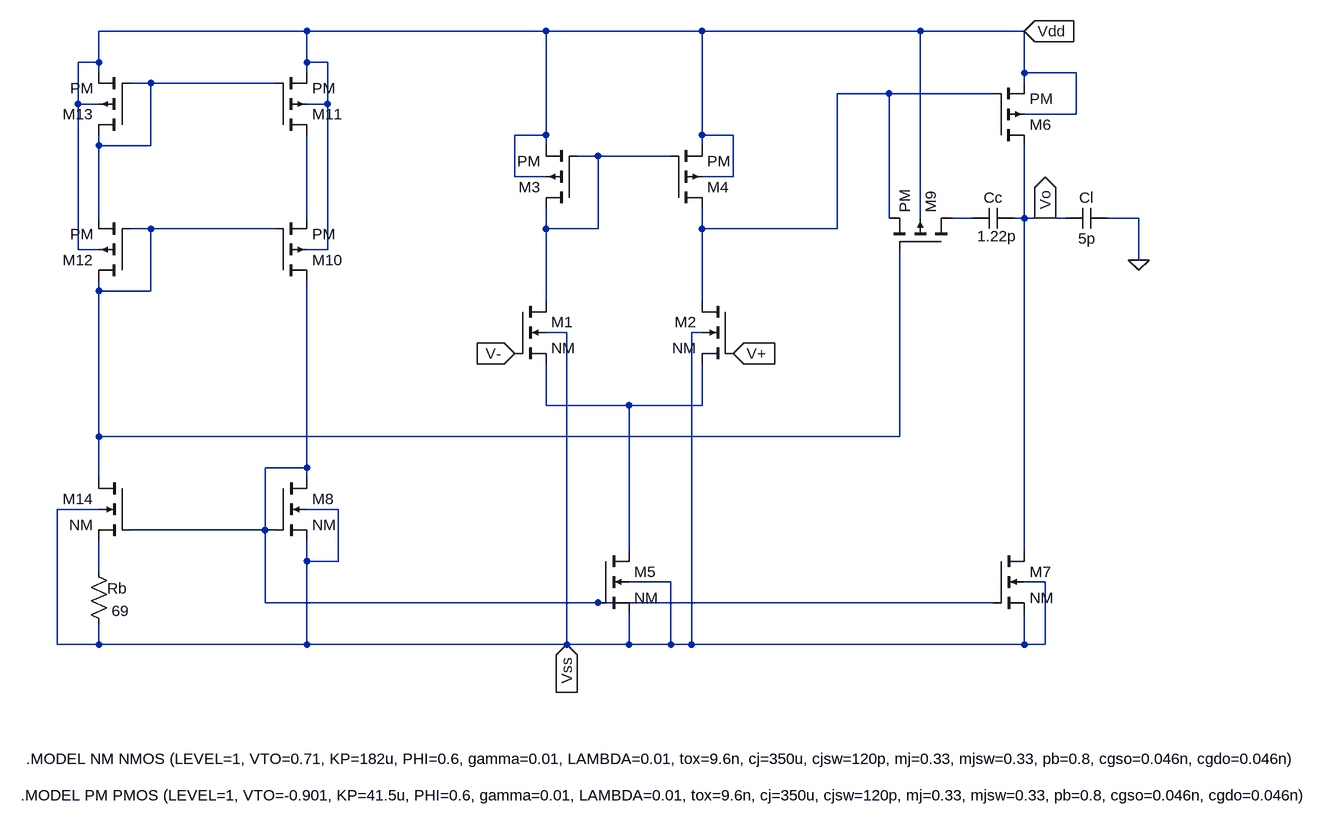
[diagram p0: schematic modified_schematic.asc]
modified_schematic.asc, the LTspice schematic file:
Version 4
SHEET 1 2312 680
WIRE 448 -816 128 -816
WIRE 816 -816 448 -816
WIRE 1056 -816 816 -816
WIRE 1392 -816 1056 -816
WIRE 1552 -816 1392 -816
WIRE 128 -768 128 -816
WIRE 128 -768 96 -768
WIRE 448 -768 448 -816
WIRE 480 -768 448 -768
WIRE 128 -752 128 -768
WIRE 448 -752 448 -768
WIRE 1552 -752 1552 -816
WIRE 1632 -752 1552 -752
WIRE 208 -736 176 -736
WIRE 400 -736 208 -736
WIRE 1552 -736 1552 -752
WIRE 1344 -720 1264 -720
WIRE 1504 -720 1344 -720
WIRE 96 -704 96 -768
WIRE 128 -704 96 -704
WIRE 480 -704 480 -768
WIRE 480 -704 448 -704
WIRE 1632 -688 1632 -752
WIRE 1632 -688 1552 -688
WIRE 816 -656 816 -816
WIRE 816 -656 768 -656
WIRE 1056 -656 1056 -816
WIRE 1104 -656 1056 -656
WIRE 128 -640 128 -656
WIRE 208 -640 208 -736
WIRE 208 -640 128 -640
WIRE 816 -640 816 -656
WIRE 1056 -640 1056 -656
WIRE 896 -624 864 -624
WIRE 1008 -624 896 -624
WIRE 768 -592 768 -656
WIRE 816 -592 768 -592
WIRE 1104 -592 1104 -656
WIRE 1104 -592 1056 -592
WIRE 128 -528 128 -640
WIRE 448 -528 448 -656
WIRE 1344 -528 1344 -720
WIRE 1392 -528 1392 -816
WIRE 1472 -528 1440 -528
WIRE 1552 -528 1552 -640
WIRE 1552 -528 1536 -528
WIRE 1584 -528 1552 -528
WIRE 1616 -528 1584 -528
WIRE 1728 -528 1680 -528
WIRE 208 -512 176 -512
WIRE 400 -512 208 -512
WIRE 816 -512 816 -544
WIRE 896 -512 896 -624
WIRE 896 -512 816 -512
WIRE 1056 -512 1056 -544
WIRE 1264 -512 1264 -720
WIRE 1264 -512 1056 -512
WIRE 96 -480 96 -704
WIRE 128 -480 96 -480
WIRE 480 -480 480 -704
WIRE 480 -480 448 -480
WIRE 1728 -464 1728 -528
WIRE 128 -416 128 -432
WIRE 208 -416 208 -512
WIRE 208 -416 128 -416
WIRE 816 -400 816 -512
WIRE 1056 -400 1056 -512
WIRE 848 -352 816 -352
WIRE 1056 -352 1040 -352
WIRE 816 -240 816 -304
WIRE 944 -240 816 -240
WIRE 1056 -240 1056 -304
WIRE 1056 -240 944 -240
WIRE 128 -192 128 -416
WIRE 1360 -192 1360 -480
WIRE 1360 -192 128 -192
WIRE 448 -144 448 -432
WIRE 448 -144 384 -144
WIRE 128 -128 128 -192
WIRE 448 -128 448 -144
WIRE 128 -80 64 -80
WIRE 496 -80 448 -80
WIRE 384 -48 384 -144
WIRE 384 -48 176 -48
WIRE 400 -48 384 -48
WIRE 944 -16 944 -240
WIRE 1552 -16 1552 -528
WIRE 448 0 448 -32
WIRE 496 0 496 -80
WIRE 496 0 448 0
WIRE 128 16 128 -32
WIRE 1008 32 944 32
WIRE 1584 32 1552 32
WIRE 384 64 384 -48
WIRE 896 64 384 64
WIRE 1504 64 896 64
WIRE 64 128 64 -80
WIRE 128 128 128 96
WIRE 128 128 64 128
WIRE 448 128 448 0
WIRE 448 128 128 128
WIRE 848 128 848 -352
WIRE 848 128 448 128
WIRE 944 128 944 80
WIRE 944 128 848 128
WIRE 1008 128 1008 32
WIRE 1008 128 944 128
WIRE 1040 128 1040 -352
WIRE 1040 128 1008 128
WIRE 1552 128 1552 80
WIRE 1552 128 1040 128
WIRE 1584 128 1584 32
WIRE 1584 128 1552 128
FLAG 1728 -464 0
FLAG 1552 -816 Vdd
IOPIN 1552 -816 In
FLAG 848 128 Vss
IOPIN 848 128 In
FLAG 1104 -320 V+
IOPIN 1104 -320 In
FLAG 768 -320 V-
IOPIN 768 -320 In
FLAG 1584 -528 Vo
IOPIN 1584 -528 Out
SYMBOL nmos4 400 -128 R0
SYMATTR InstName M8
SYMATTR Value2 l=1u w=4.58u
SYMATTR Value NM
SYMBOL nmos4 176 -128 M0
SYMATTR InstName M14
SYMATTR Value2 l=1u w=4.58u
SYMATTR Value NM
SYMBOL nmos4 768 -400 R0
SYMATTR InstName M1
SYMATTR Value2 l=1u w=0.66u
SYMATTR Value NM
SYMBOL nmos4 1104 -400 M0
SYMATTR InstName M2
SYMATTR Value2 l=1u w=0.66u
SYMATTR Value NM
SYMBOL nmos4 896 -16 R0
SYMATTR InstName M5
SYMATTR Value2 l=1u w=4.58u
SYMATTR Value NM
SYMBOL nmos4 1504 -16 R0
SYMATTR InstName M7
SYMATTR Value2 l=1u w=23.23u
SYMATTR Value NM
SYMBOL pmos4 864 -544 R180
SYMATTR InstName M3
SYMATTR Value2 l=1u w=3.3u
SYMATTR Value PM
SYMBOL pmos4 176 -656 R180
SYMATTR InstName M13
SYMATTR Value2 l=1u w=6.57u
SYMATTR Value PM
SYMBOL pmos4 176 -432 R180
SYMATTR InstName M12
SYMATTR Value2 l=1u w=6.57u
SYMATTR Value PM
SYMBOL pmos4 400 -432 M180
SYMATTR InstName M10
SYMATTR Value2 l=1u w=6.57u
SYMATTR Value PM
SYMBOL pmos4 400 -656 M180
SYMATTR InstName M11
SYMATTR Value2 l=1u w=6.57u
SYMATTR Value PM
SYMBOL pmos4 1008 -544 M180
SYMATTR InstName M4
SYMATTR Value2 l=1u w=3.3u
SYMATTR Value PM
SYMBOL pmos4 1504 -640 M180
SYMATTR InstName M6
SYMATTR Value2 l=1u w=33.35u
SYMATTR Value PM
SYMBOL pmos4 1440 -480 M270
SYMATTR InstName M9
SYMATTR Value2 l=1u w=6.57u
SYMATTR Value PM
SYMBOL res 112 0 R0
WINDOW 0 29 42 Left 2
SYMATTR InstName Rb
SYMATTR Value 69
SYMBOL cap 1536 -544 R90
WINDOW 0 0 32 VBottom 2
WINDOW 3 59 26 VBottom 2
SYMATTR InstName Cc
SYMATTR Value 1.22p
SYMBOL cap 1680 -544 R90
WINDOW 0 0 32 VBottom 2
WINDOW 3 32 32 VTop 2
SYMATTR InstName Cl
SYMATTR Value 5p
TEXT 8 360 Left 2 !.MODEL PM PMOS (LEVEL=1, VTO=-0.901, KP=41.5u, PHI=0.6, gamma=0.01, LAMBDA=0.01, tox=9.6n, cj=350u, cjsw=120p, mj=0.33, mjsw=0.33, pb=0.8, cgso=0.046n, cgdo=0.046n)
TEXT 16 304 Left 2 !.MODEL NM NMOS (LEVEL=1, VTO=0.71, KP=182u, PHI=0.6, gamma=0.01, LAMBDA=0.01, tox=9.6n, cj=350u, cjsw=120p, mj=0.33, mjsw=0.33, pb=0.8, cgso=0.046n, cgdo=0.046n)

The netlist it stands for:
* modified_schematic.asc
M8 N008 N008 Vss Vss NM l=1u w=4.58u
M14 N006 N008 N009 Vss NM l=1u w=4.58u
M1 N003 V- N007 Vss NM l=1u w=0.66u
M2 N002 V+ N007 Vss NM l=1u w=0.66u
M5 N007 N008 Vss Vss NM l=1u w=4.58u
M7 Vo N008 Vss Vss NM l=1u w=23.23u
M3 N003 N003 Vdd Vdd PM l=1u w=3.3u
M13 N001 N001 Vdd Vdd PM l=1u w=6.57u
M12 N006 N006 N001 Vdd PM l=1u w=6.57u
M10 N008 N006 N004 Vdd PM l=1u w=6.57u
M11 N004 N001 Vdd Vdd PM l=1u w=6.57u
M4 N002 N003 Vdd Vdd PM l=1u w=3.3u
M6 Vo N002 Vdd Vdd PM l=1u w=33.35u
M9 N005 N006 N002 Vdd PM l=1u w=6.57u
Rb N009 Vss 69
Cc Vo N005 1.22p
Cl 0 Vo 5p
.model NMOS NMOS
.model PMOS PMOS
.lib standard.mos
.MODEL PM PMOS (LEVEL=1, VTO=-0.901, KP=41.5u, PHI=0.6, gamma=0.01, LAMBDA=0.01, tox=9.6n, cj=350u, cjsw=120p, mj=0.33, mjsw=0.33, pb=0.8, cgso=0.046n, cgdo=0.046n)
.MODEL NM NMOS (LEVEL=1, VTO=0.71, KP=182u, PHI=0.6, gamma=0.01, LAMBDA=0.01, tox=9.6n, cj=350u, cjsw=120p, mj=0.33, mjsw=0.33, pb=0.8, cgso=0.046n, cgdo=0.046n)
.backanno
.end